# EAGLE design 64NIC+v1.3 (EAGLE 5.11)
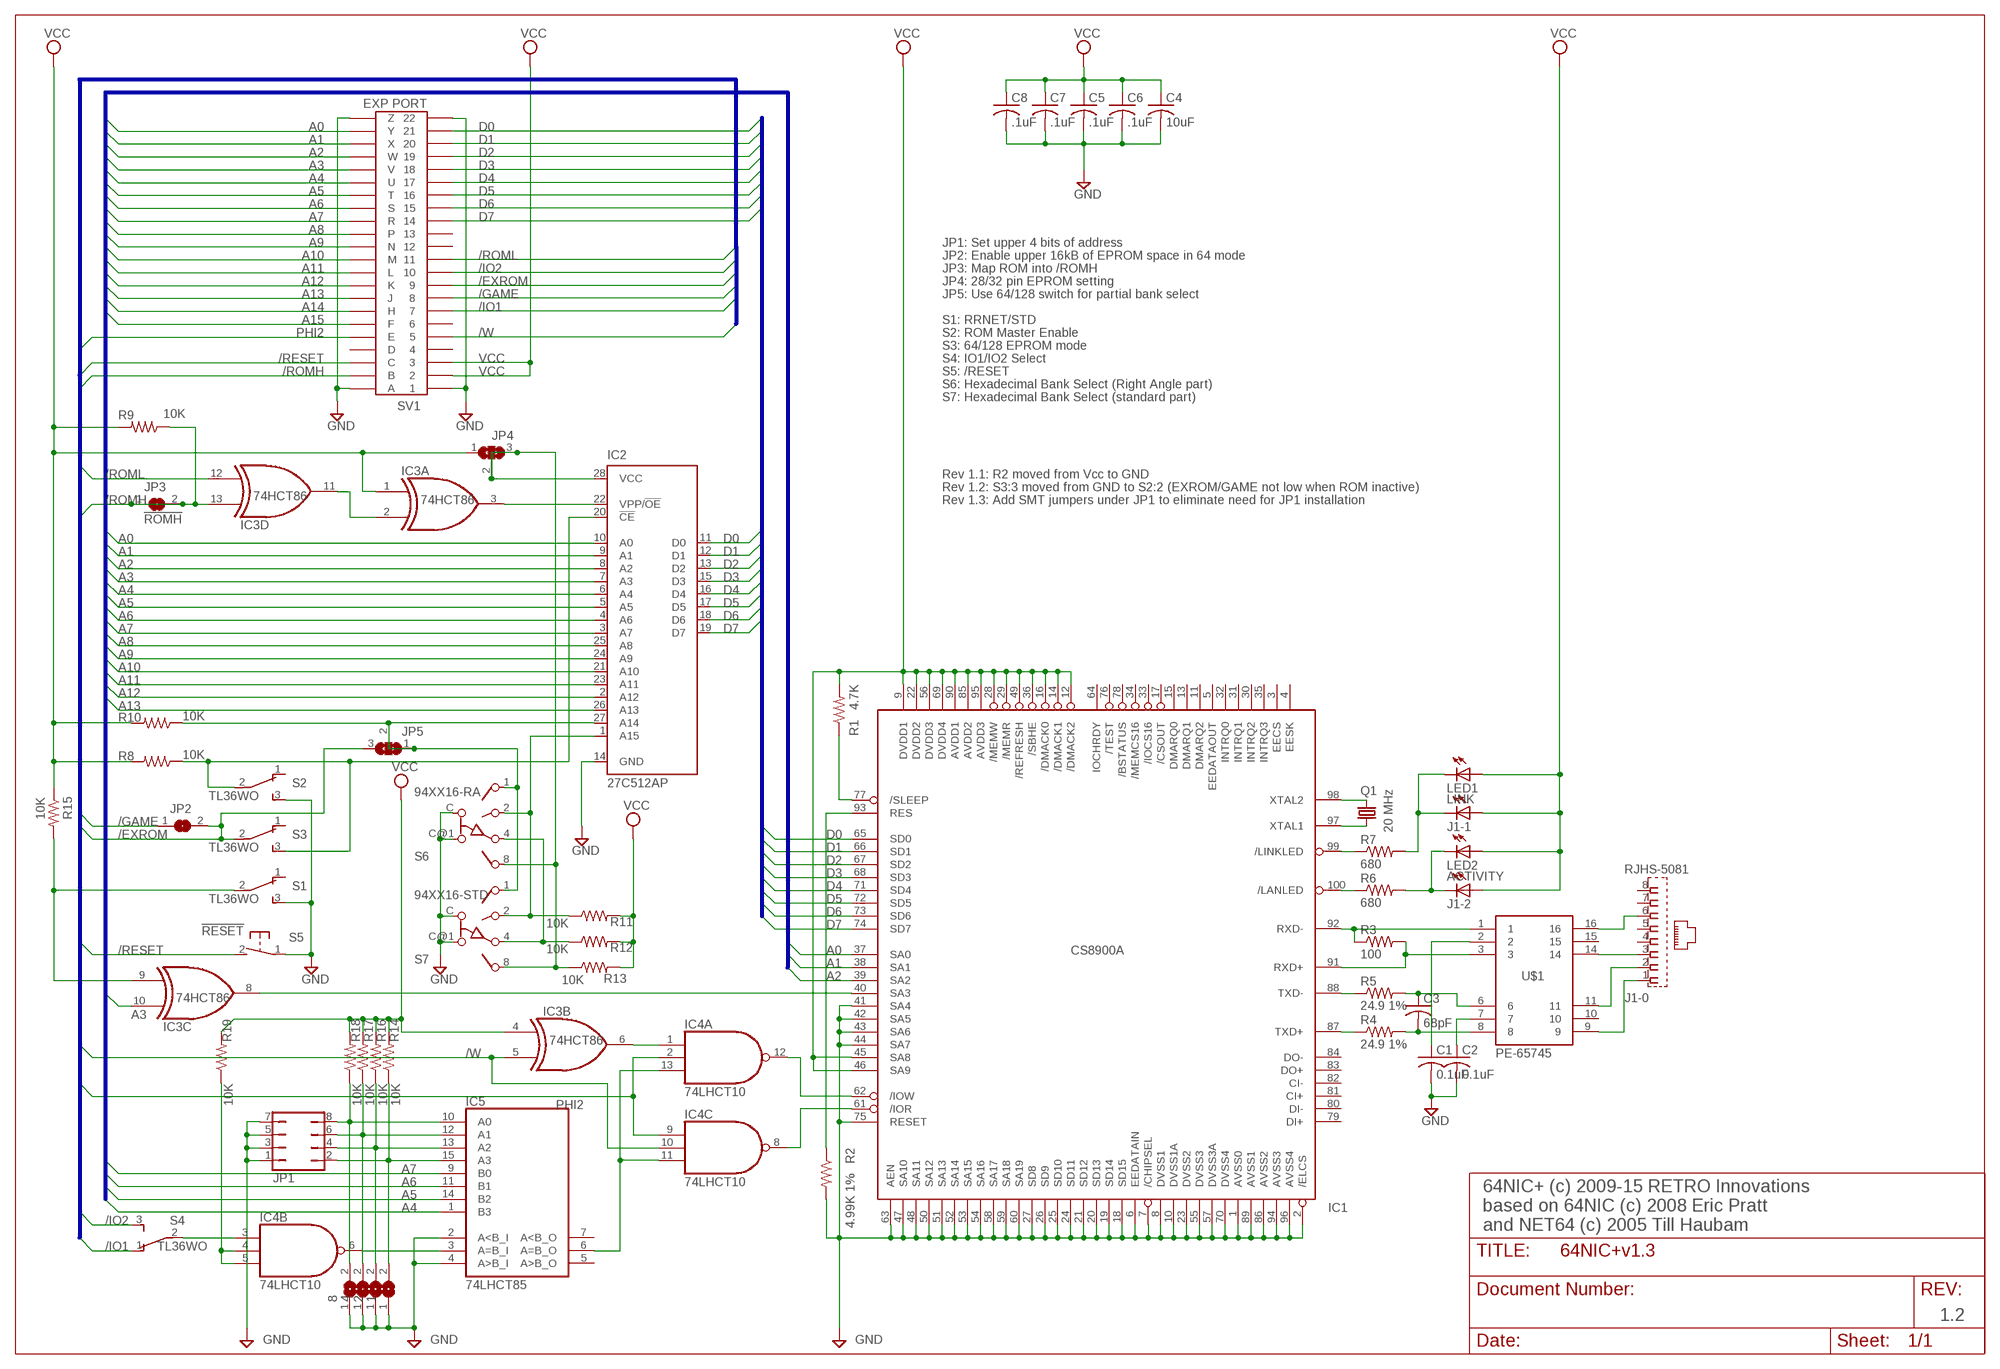
[diagram p0: schematic, sheet 1]

## Parts
1  SJ  [SJ]
2  SJ  [SJ]
4  SJ  [SJ]
8  SJ  [SJ]
C1  0.1uF  C-USC0805  [C0805]
C2  0.1uF  C-USC0805  [C0805]
C3  68pF  C-USC0805  [C0805]
C4  10uF  C-USC0805  [C0805]
C5  .1uF  C-USC0805  [C0805]
C6  .1uF  C-USC0805  [C0805]
C7  .1uF  C-USC0805  [C0805]
C8  .1uF  C-USC0805  [C0805]
IC1  CS8900A  [TQFP100]
IC2  27C512AP  [DIL28-6]
IC3  74HCT86  74S86D  [SO14]
IC4  74LHCT10  74LS10D  [SO14]
IC5  74LHCT85  74LS85D  [SO16]
J1  RJHS-5081  [RJHS-508]
JP1  JP4Q  [JP4Q]
JP2  SJ  [SJ]
JP3  !ROMH  SJ  [SJ]
JP4  SJ2W  [SJ_2]
JP5  SJ2W  [SJ_2]
LED1  LINK  LED3MM  [LED3MM]
LED2  ACTIVITY  LED3MM  [LED3MM]
Q1  20 MHz  CRYSTALHC49S  [HC49/S]
R1  4.7K  R-US_R0805  [R0805]
R2  4.99K 1%  R-US_R0805  [R0805]
R3  100  R-US_R0805  [R0805]
R4  24.9 1%  R-US_R0805  [R0805]
R5  24.9 1%  R-US_R0805  [R0805]
R6  680  R-US_R0805  [R0805]
R7  680  R-US_R0805  [R0805]
R8  10K  R-US_R0805  [R0805]
R9  10K  R-US_R0805  [R0805]
R10  10K  R-US_R0805  [R0805]
R11  10K  R-US_R0805  [R0805]
R12  10K  R-US_R0805  [R0805]
R13  10K  R-US_R0805  [R0805]
R14  10K  R-US_R0805  [R0805]
R15  10K  R-US_R0805  [R0805]
R16  10K  R-US_R0805  [R0805]
R17  10K  R-US_R0805  [R0805]
R18  10K  R-US_R0805  [R0805]
R19  10K  R-US_R0805  [R0805]
S1  TL36WO  [TL3XWO]
S2  TL36WO  [TL3XWO]
S3  TL36WO  [TL3XWO]
S4  TL36WO  [TL3XWO]
S5  !RESET  31-XX  [B3F-31XX]
S6  94XX16-RA  [HEX_SW_RA]
S7  94XX16-STD  [HEX-SW]
SV1  EXP PORT  44PINEDGE  [44PINEDGE]
U$1  PE-65745  [SMT4]

## Nets
/EXROM: JP2.2 JP5.3 S3.2(P) SV1.9
/GAME: JP2.1 SV1.8
/IO1: S4.1(O) SV1.7
/IO2: S4.3(S) SV1.10
/RESET: S5.2(S) SV1.C
/ROMH: IC3.13(D:I1) JP3.1 JP3.2 R9.1 SV1.B
/ROML: IC3.12(D:I0) SV1.11
/W: IC3.5(B:I1) IC4.10(C:I1) SV1.5
A0: IC1.37(SA0) IC2.10(A0) SV1.Y
A1: IC1.38(SA1) IC2.9(A1) SV1.X
A2: IC1.39(SA2) IC2.8(A2) SV1.W
A3: IC2.7(A3) IC3.10(C:I1) SV1.V
A4: IC2.6(A4) IC5.1(B3) SV1.U
A5: IC2.5(A5) IC5.14(B2) SV1.T
A6: IC2.4(A6) IC5.11(B1) SV1.S
A7: IC2.3(A7) IC5.9(B0) SV1.R
A8: IC2.25(A8) SV1.P
A9: IC2.24(A9) SV1.N
A10: IC2.21(A10) SV1.M
A11: IC2.23(A11) SV1.L
A12: IC2.2(A12) SV1.K
A13: IC2.26(A13) SV1.J
A14: SV1.H
A15: SV1.F
D0: IC1.65(SD0) IC2.11(D0) SV1.21
D1: IC1.66(SD1) IC2.12(D1) SV1.20
D2: IC1.67(SD2) IC2.13(D2) SV1.19
D3: IC1.68(SD3) IC2.15(D3) SV1.18
D4: IC1.71(SD4) IC2.16(D4) SV1.17
D5: IC1.72(SD5) IC2.17(D5) SV1.16
D6: IC1.73(SD6) IC2.18(D6) SV1.15
D7: IC1.74(SD7) IC2.19(D7) SV1.14
GND: 1.1 2.1 4.1 8.1 C1.2 C2.2 C4.2 C5.2 C6.2 C7.2 C8.2 IC1.1(AVSS0) IC1.2(/ELCS) IC1.6(EEDATAIN) IC1.7(/CHIPSEL) IC1.8(DVSS1) IC1.10(DVSS1A) IC1.18(SD15) IC1.19(SD14) IC1.20(SD13) IC1.21(SD12) IC1.23(DVSS2) IC1.24(SD11) IC1.25(SD10) IC1.26(SD9) IC1.27(SD8) IC1.41(SA4) IC1.42(SA5) IC1.43(SA6) IC1.44(SA7) IC1.47(SA10) IC1.48(SA11) IC1.50(SA12) IC1.51(SA13) IC1.52(SA14) IC1.53(SA15) IC1.54(SA16) IC1.55(DVSS3) IC1.57(DVSS3A) IC1.58(SA17) IC1.59(SA18) IC1.60(SA19) IC1.63(AEN) IC1.70(DVSS4) IC1.75(RESET) IC1.86(AVSS2) IC1.89(AVSS1) IC1.94(AVSS3) IC1.96(AVSS4) IC2.14(GND) IC5.2(A<B_I) IC5.4(A>B_I) JP1.1 JP1.3 JP1.5 JP1.7 R2.2 S1.3(S) S2.3(S) S5.1(P) S6.C S6.C@1(C) S7.C S7.C@1(C) SV1.1 SV1.22 SV1.A SV1.Z
N$1: IC1.40(SA3) IC3.8(C:O)
N$2: IC1.98(XTAL2) Q1.2
N$3: IC1.97(XTAL1) Q1.1
N$4: IC2.22(VPP/!OE) IC3.3(A:O)
N$5: IC3.2(A:I1) IC3.11(D:O)
N$6: IC1.93(RES) R2.1
N$7: IC1.77(/SLEEP) R1.1
N$8: IC1.62(/IOW) IC4.12(A:O)
N$9: IC1.61(/IOR) IC4.8(C:O)
N$10: IC4.11(C:I2) IC4.13(A:I2) IC5.6(A=B_O)
N$12: IC4.3(B:I0) S4.2(P)
N$14: IC4.6(B:O) IC5.3(A=B_I)
N$15: IC3.6(B:O) IC4.1(A:I0)
N$17: IC4.4(B:I1) IC4.5(B:I2) R19.1
N$19: 8.2 IC5.10(A0) JP1.8 R18.1
N$22: 4.2 IC5.12(A1) JP1.6 R17.1
N$23: IC1.92(RXD-) R3.1 U$1.1
N$24: IC1.91(RXD+) R3.2 U$1.3
N$25: IC1.88(TXD-) R5.1
N$26: IC1.87(TXD+) R4.1
N$27: C3.1 R5.2 U$1.6
N$28: C3.2 R4.2 U$1.8
N$29: J1.6 U$1.16
N$30: J1.3 U$1.14
N$31: J1.2 U$1.11
N$32: J1.1 U$1.9
N$33: IC1.99(/LINKLED) R7.1
N$34: IC1.100(/LANLED) R6.1
N$35: J1.9(-1:C) LED1.K(C) R7.2
N$36: J1.11(-2:C) LED2.K(C) R6.2
N$37: C2.1 U$1.7
N$38: C1.1 U$1.2
N$39: 2.2 IC5.13(A2) JP1.4 R16.1
N$40: 1.2 IC5.15(A3) JP1.2 R14.1
N$43: IC2.20(!CE) R8.1 S2.2(P) S3.3(S)
N$48: IC3.9(C:I0) R15.2 S1.2(P)
PHI2: IC4.2(A:I1) IC4.9(C:I0) SV1.E
TA14: IC2.27(A14) JP5.1 JP5.2 R10.1 S6.1 S7.1
TA15: IC2.1(A15) R11.1 S6.2 S7.2
TA16: R12.1 S6.4 S7.4
TA17: IC2.28(VCC) JP4.2 JP4.3 R13.1 S6.8 S7.8
VCC: C4.1 C5.1 C6.1 C7.1 C8.1 IC1.9(DVDD1) IC1.12(/DMACK2) IC1.14(/DMACK1) IC1.16(/DMACK0) IC1.22(DVDD2) IC1.28(/MEMW) IC1.29(/MEMR) IC1.36(/SBHE) IC1.45(SA8) IC1.46(SA9) IC1.49(/REFRESH) IC1.56(DVDD3) IC1.69(DVDD4) IC1.85(AVDD2) IC1.90(AVDD1) IC1.95(AVDD3) IC3.1(A:I0) IC3.4(B:I0) J1.10(-1:A) J1.12(-2:A) JP4.1 LED1.A LED2.A R1.2 R8.2 R9.2 R10.2 R11.2 R12.2 R13.2 R14.2 R15.1 R16.2 R17.2 R18.2 R19.2 SV1.2 SV1.3
Unconnected: IC1.3(EECS) IC1.4(EESK) IC1.5(EEDATAOUT) IC1.11(DMARQ2) IC1.13(DMARQ1) IC1.15(DMARQ0) IC1.17(/CSOUT) IC1.30(INTRQ2) IC1.31(INTRQ1) IC1.32(INTRQ0) IC1.33(/IOCS16) IC1.34(/MEMCS16) IC1.35(INTRQ3) IC1.64(IOCHRDY) IC1.76(/TEST) IC1.78(/BSTATUS) IC1.79(DI+) IC1.80(DI-) IC1.81(CI+) IC1.82(CI-) IC1.83(DO+) IC1.84(DO-) IC5.5(A>B_O) IC5.7(A<B_O) J1.4 J1.5 J1.7 J1.8 S1.1(O) S2.1(O) S3.1(O) SV1.4 SV1.6 SV1.12 SV1.13 SV1.D U$1.10 U$1.15

## Buses
D[0..7]
A[0..15]
/R,/IO1,/GAME,/EXROM,/IO2,/ROML,/ROMH,/RESET,PHI2,/W

## Notes on the sheet
- JP1: Set upper 4 bits of address
- JP2: Enable upper 16kB of EPROM space in 64 mode
- JP3: Map ROM into /ROMH
- JP4: 28/32 pin EPROM setting
- JP5: Use 64/128 switch for partial bank select
- S1: RRNET/STD
- S2: ROM Master Enable
- S3: 64/128 EPROM mode
- S4: IO1/IO2 Select
- S5: /RESET
- S6: Hexadecimal Bank Select (Right Angle part)
- S7: Hexadecimal Bank Select (standard part)
- Rev 1.1: R2 moved from Vcc to GND
- Rev 1.2: S3:3 moved from GND to S2:2 (EXROM/GAME not low when ROM inactive)
- Rev 1.3: Add SMT jumpers under JP1 to eliminate need for JP1 installation
- 64NIC+ (c) 2009-15 RETRO Innovations
- based on 64NIC (c) 2008 Eric Pratt
- and NET64 (c) 2005 Till Haubam
- 1.2

## Power pins joined to a net without a drawn wire
GND: IC3.7(P:GND) IC4.7(P:GND) IC5.8(GND)
VCC: IC3.14(P:VCC) IC4.14(P:VCC) IC5.16(VCC)

## Library data of the parts
1 2 4 8 JP2 JP3 = jumper:SJ: SMD solder JUMPER
C1-C8 = rcl:C-US: CAPACITOR, American symbol
IC1 = cirrus-v1.0.2:CS8900A: Crystal LAN(TM) Ethernet Controller (Optimized for 8-bit mode applications)
IC2 = microchip:27*512A: CMOS EPROM 512 K (64 K x 8)
IC3 = 74xx-us:74*86: Quad 2-input EXCLUSIV-OR (XOR) gate
IC4 = 74xx-us:74*10: Triple 3-input NAND gate
IC5 = 74xx-us:74*85: 4-bit magnitude COMPARATOR
J1 = C64NIC:RJHS-508: MODULAR JACK 8 POS., RIGHT ANGLE, LOW PROFILE WITH LEDS
JP1 = jumper:JP4Q: JUMPER
JP4 JP5 = jumper:SJ2W: SMD solder JUMPER
LED1 LED2 = led:LED: LED OSRAM: - CHIPLED LG R971, LG N971, LY N971, LG Q971, LY Q971, LO R971, LY R971 LH N974, LH R974 LS Q976, LO Q976, LY Q976 LO Q996 - Hyper CHIPLED LW Q18S LB Q993, LB Q99A, LB R99A - SideLED LS A670, LO A670, LY A670, LG A670, LP A670 LB A673, LV A673, LT A673, LW A673 LH A674 LY A675 LS A676, LA A676, LO A676, LY A676, LW A676 LS A679, LY A679, LG A679 - Hyper Micro SIDELED® LS Y876, LA Y876, LO Y876, LY Y876 LT Y87S - SmartLED LW L88C, LW L88S LB L89C, LB L89S, LG L890 LS L89K, LO L89K, LY L89K LS L896, LA L896, LO L896, LY L896 - TOPLED LS T670, LO T670, LY T670, LG T670, LP T670 LSG T670, LSP T670, LSY T670, LOP T670, LYG T670 LG T671, LOG T671, LSG T671 LB T673, LV T673, LT T673, LW T673 LH T674 LS T676, LA T676, LO T676, LY T676, LB T676, LH T676, LSB T676, LW T676 LB T67C, LV T67C, LT T67C, LS T67K, LO T67K, LY T67K, LW E67C LS E67B, LA E67B, LO E67B, LY E67B, LB E67C, LV E67C, LT E67C LW T67C LS T679, LY T679, LG T679 LS T770, LO T770, LY T770, LG T770, LP T770 LB T773, LV T773, LT T773, LW T773 LH T774 LS E675, LA E675, LY E675, LS T675 LS T776, LA T776, LO T776, LY T776, LB T776 LHGB T686 LT T68C, LB T68C - Hyper Mini TOPLED® LB M676 - Mini TOPLED Santana® LG M470 LS M47K, LO M47K, LY M47K Source: http://www.osram.convergy.de LUXEON: - LUMILED® LXK2-PW12-R00, LXK2-PW12-S00, LXK2-PW14-U00, LXK2-PW14-V00 LXK2-PM12-R00, LXK2-PM12-S00, LXK2-PM14-U00 LXK2-PE12-Q00, LXK2-PE12-R00, LXK2-PE12-S00, LXK2-PE14-T00, LXK2-PE14-U00 LXK2-PB12-K00, LXK2-PB12-L00, LXK2-PB12-M00, LXK2-PB14-N00, LXK2-PB14-P00, LXK2-PB14-Q00 LXK2-PR12-L00, LXK2-PR12-M00, LXK2-PR14-Q00, LXK2-PR14-R00 LXK2-PD12-Q00, LXK2-PD12-R00, LXK2-PD12-S00 LXK2-PH12-R00, LXK2-PH12-S00 LXK2-PL12-P00, LXK2-PL12-Q00, LXK2-PL12-R00 Source: www.luxeon.com KINGBRIGHT: KA-3528ASYC Source: www.kingbright.com
Q1 = crystal:CRYSTAL: CRYSTAL
R1-R19 = resistor:R-US_: RESISTOR, American symbol
S1-S4 = switch:TL36WO: TINY SWITCH ON - ON Source: http://www2.produktinfo.conrad.com/datenblaetter/700000-724999/705152-da-01-de-Subminiaturschalter_TL_36WO.pdf
S5 = switch-omron:31-XX: OMRON SWITCH
S6 S7 = switch-grayhill:94XX16
SV1 = edge-100:44PINEDGE: 44 PIN EDGE CONNECTOR FOR PCB
U$1 = C64NIC:PE-65745: 10Base-T Isolation Transformer - Rx ratio = 1:1; Tx ratio = 1:1.414

## Board
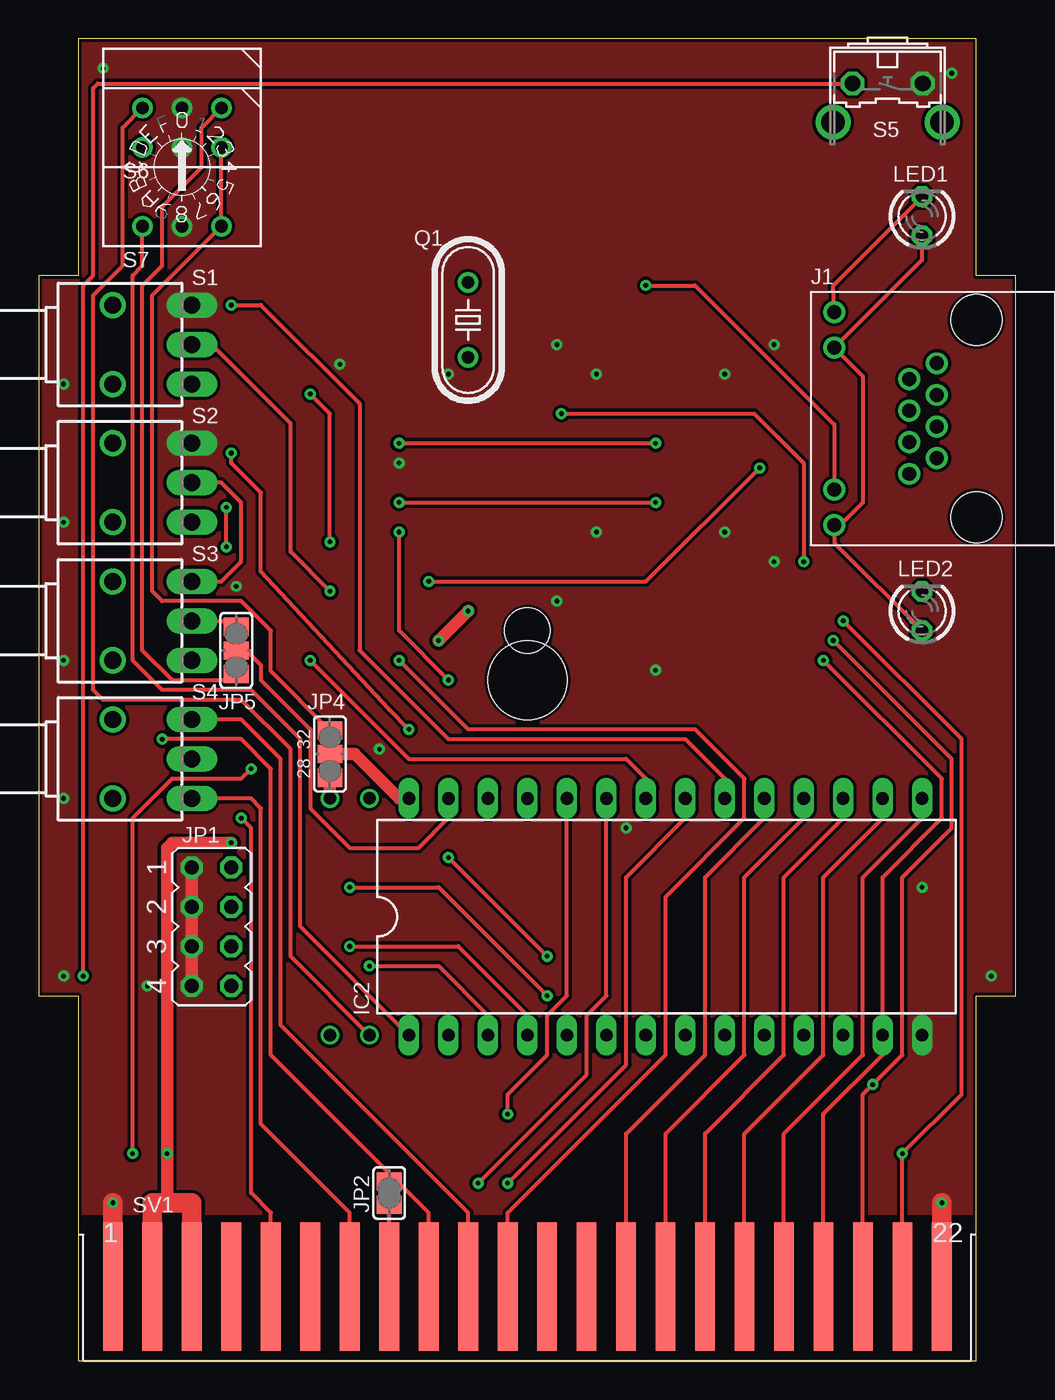
[diagram p1: board, top side]
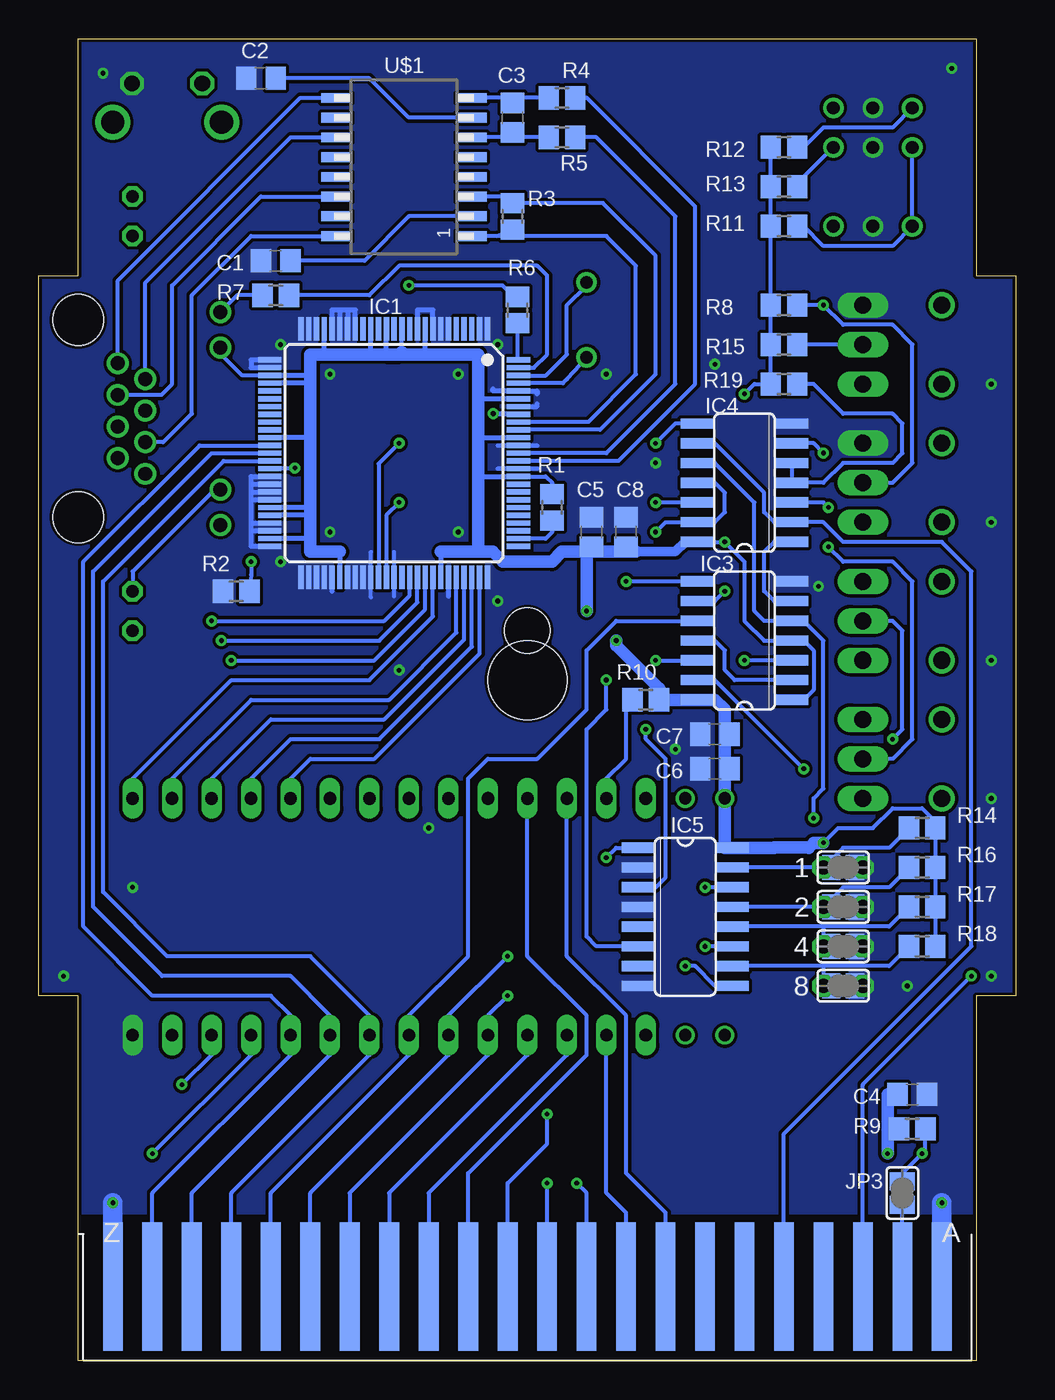
[diagram p2: board, bottom side, seen from below]

Size 62.86 x 85.08 mm. Coordinates in mm from the lower left corner, seen from the top.
Outline: 2.54,0 60.32,0 60.32,23.49 62.86,23.49 62.86,69.85 60.32,69.85 60.32,85.08 2.54,85.08 2.54,69.85 0,69.85 0,23.49 2.54,23.49 2.54,0
Copper layers (1*16): Top 0.035mm / dielectric 1.5mm / Bottom 0.035mm
Design rules "default *": minimum track width 8mil, minimum drill 8mil, track to track 8mil, track to pad 8mil, pad to pad 8mil, via to via 8mil, smd to smd 8mil, copper to edge 8mil, drill to drill 8mil, minimum pad ring 10mil, minimum via ring 8mil, stop-mask expansion 4mil, vias tented up to drill 0mil, thermal gap 10mil
Holes 5.08 mm at 31.43,43.81
Holes 2.92 mm at 31.43,46.98
bRestrict: area 10.8,30.8 to 11.1,32.7; area 10.8,28.3 to 11.1,30.2; area 10.8,25.7 to 11.1,27.6; area 10.8,23.2 to 11.1,25.1

### Footprints (pad centres in the part's own frame; a part is rotated, then mirrored left to right if it is on the bottom)
SJ = smd 1.168 x 1.6: 1 -0.762,0; 2 0.762,0
C0805 = smd 1.3 x 1.5: 1 -0.95,0; 2 0.95,0
TQFP100 = smd 1.5 x 0.34: 1 -8,6; 2 -8,5.5; 3 -8,5; 4 -8,4.5; 5 -8,4; 6 -8,3.5; 7 -8,3; 8 -8,2.5; 9 -8,2; 10 -8,1.5; 11 -8,1; 12 -8,0.5; 13 -8,0; 14 -8,-0.5; 15 -8,-1; 16 -8,-1.5; 17 -8,-2; 18 -8,-2.5; 19 -8,-3; 20 -8,-3.5; 21 -8,-4; 22 -8,-4.5; 23 -8,-5; 24 -8,-5.5; 25 -8,-6; 51 8,-6; 52 8,-5.5; 53 8,-5; 54 8,-4.5; 55 8,-4; 56 8,-3.5; 57 8,-3; 58 8,-2.5; 59 8,-2; 60 8,-1.5; 61 8,-1; 62 8,-0.5; 63 8,0; 64 8,0.5; 65 8,1; 66 8,1.5; 67 8,2; 68 8,2.5; 69 8,3; 70 8,3.5; 71 8,4; 72 8,4.5; 73 8,5; 74 8,5.5; 75 8,6 | smd 0.34 x 1.5: 26 -6,-8; 27 -5.5,-8; 28 -5,-8; 29 -4.5,-8; 30 -4,-8; 31 -3.5,-8; 32 -3,-8; 33 -2.5,-8; 34 -2,-8; 35 -1.5,-8; 36 -1,-8; 37 -0.5,-8; 38 0,-8; 39 0.5,-8; 40 1,-8; 41 1.5,-8; 42 2,-8; 43 2.5,-8; 44 3,-8; 45 3.5,-8; 46 4,-8; 47 4.5,-8; 48 5,-8; 49 5.5,-8; 50 6,-8; 76 6,8; 77 5.5,8; 78 5,8; 79 4.5,8; 80 4,8; 81 3.5,8; 82 3,8; 83 2.5,8; 84 2,8; 85 1.5,8; 86 1,8; 87 0.5,8; 88 0,8; 89 -0.5,8; 90 -1,8; 91 -1.5,8; 92 -2,8; 93 -2.5,8; 94 -3,8; 95 -3.5,8; 96 -4,8; 97 -4.5,8; 98 -5,8; 99 -5.5,8; 100 -6,8
DIL28-6 = drill 0.813 long: 1 -16.51,-7.62; 2 -13.97,-7.62; 3 -11.43,-7.62; 4 -8.89,-7.62; 5 -6.35,-7.62; 6 -3.81,-7.62; 7 -1.27,-7.62; 8 1.27,-7.62; 9 3.81,-7.62; 10 6.35,-7.62; 11 8.89,-7.62; 12 11.43,-7.62; 13 13.97,-7.62; 14 16.51,-7.62; 15 16.51,7.62; 16 13.97,7.62; 17 11.43,7.62; 18 8.89,7.62; 19 6.35,7.62; 20 3.81,7.62; 21 1.27,7.62; 22 -1.27,7.62; 23 -3.81,7.62; 24 -6.35,7.62; 25 -8.89,7.62; 26 -11.43,7.62; 27 -13.97,7.62; 28 -16.51,7.62
SO14 = smd 0.66 x 2.032: 1 -3.81,-3.073; 2 -2.54,-3.073; 3 -1.27,-3.073; 4 0,-3.073; 5 1.27,-3.073; 6 2.54,-3.073; 7 3.81,-3.073; 8 3.81,3.073; 9 2.54,3.073; 10 1.27,3.073; 11 0,3.073; 12 -1.27,3.073; 13 -2.54,3.073; 14 -3.81,3.073
SO16 = smd 0.66 x 2.032: 1 -4.445,-3.073; 2 -3.175,-3.073; 3 -1.905,-3.073; 4 -0.635,-3.073; 5 0.635,-3.073; 6 1.905,-3.073; 7 3.175,-3.073; 8 4.445,-3.073; 9 4.445,3.073; 10 3.175,3.073; 11 1.905,3.073; 12 0.635,3.073; 13 -0.635,3.073; 14 -1.905,3.073; 15 -3.175,3.073; 16 -4.445,3.073
RJHS-508 = drill 0.9 round: 1 3.556,-1.27; 2 2.54,0.508; 3 1.524,-1.27; 4 0.508,0.508; 5 -0.508,-1.27; 6 -1.524,0.508; 7 -2.54,-1.27; 8 -3.556,0.508; 9 6.858,5.334; 10 4.572,5.334; 11 -4.572,5.334; 12 -6.858,5.334 | hole 3.264: -6.35,-3.81; 6.35,-3.81
JP4Q = drill 0.914 octagon: 1 -3.81,-1.27; 2 -3.81,1.27; 3 -1.27,-1.27; 4 -1.27,1.27; 5 1.27,-1.27; 6 1.27,1.27; 7 3.81,-1.27; 8 3.81,1.27
SJ_2 = smd 1.168 x 1.6: 1 -1.524,0; 2 0,0; 3 1.524,0
LED3MM = drill 0.813 octagon: A -1.27,0; K 1.27,0
HC49/S = drill 0.813 round: 1 -2.413,0; 2 2.413,0
R0805 = smd 1.3 x 1.5: 1 -0.85,0; 2 0.85,0
TL3XWO = drill 1.1 pad 1.422 long: 1 -2.54,-5.08; 2 0,-5.08; 3 2.54,-5.08 | drill 1.1 pad 1.676 round: M1 -2.54,0; M2 2.54,0
B3F-31XX = drill 1.016 octagon: 1 -2.261,-1.245; 2 2.261,-1.245 | drill 1.499 pad 2.159 round: 3 -3.505,1.245; 4 3.505,1.245
HEX_SW_RA = drill 0.813 round: 1 -2.54,1.27; 2 2.54,3.81; 4 2.54,1.27; 8 -2.54,3.81; C 0,3.81; C@1 0,1.27
HEX-SW = drill 0.813 round: 1 -2.54,-3.81; 2 2.54,3.81; 4 2.54,-3.81; 8 -2.54,3.81; C 0,3.81; C@1 0,-3.81
44PINEDGE = smd 1.27 x 8.255: 1 -24.765,-0.305; 2 -22.225,-0.305; 3 -19.685,-0.305; 4 -17.145,-0.305; 5 -14.605,-0.305; 6 -12.065,-0.305; 7 -9.525,-0.305; 8 -6.985,-0.305; 9 -4.445,-0.305; 10 -1.905,-0.305; 11 0.635,-0.305; 12 3.175,-0.305; 13 5.715,-0.305; 14 8.255,-0.305; 15 10.795,-0.305; 16 13.335,-0.305; 17 15.875,-0.305; 18 18.415,-0.305; 19 20.955,-0.305; 20 23.495,-0.305; 21 26.035,-0.305; 22 28.575,-0.305 | smd 1.27 x 8.255 bottom: A -24.765,-0.305; B -22.225,-0.305; C -19.685,-0.305; D -17.145,-0.305; E -14.605,-0.305; F -12.065,-0.305; H -9.525,-0.305; J -6.985,-0.305; K -4.445,-0.305; L -1.905,-0.305; M 0.635,-0.305; N 3.175,-0.305; P 5.715,-0.305; R 8.255,-0.305; S 10.795,-0.305; T 13.335,-0.305; U 15.875,-0.305; V 18.415,-0.305; W 20.955,-0.305; X 23.495,-0.305; Y 26.035,-0.305; Z 28.575,-0.305
SMT4 = smd 0.635 x 1.905: 1 -4.445,-4.362; 2 -3.175,-4.362; 3 -1.905,-4.362; 4 -0.635,-4.362; 5 0.635,-4.362; 6 1.905,-4.362; 7 3.175,-4.362; 8 4.445,-4.362; 9 4.445,4.362; 10 3.175,4.362; 11 1.905,4.362; 12 0.635,4.362; 13 -0.635,4.362; 14 -1.905,4.362; 15 -3.175,4.362; 16 -4.445,4.362

### Placement (x,y rotation side)
1  11.11,31.75 180 bottom
2  11.11,29.2 180 bottom
4  11.11,26.66 180 bottom
8  11.11,24.12 180 bottom
C1  47.62,70.8 180 bottom
C2  48.58,82.55 180 bottom
C3  32.39,80.01 90 bottom
C4  6.67,17.14 0 bottom
C5  27.3,53.34 90 bottom
C6  19.37,38.09 180 bottom
C7  19.37,40.32 180 bottom
C8  25.08,53.34 90 bottom
IC1  40,58.41 270 bottom
IC2  40.32,28.57 0 top
IC3  17.46,46.35 90 bottom
IC4  17.46,56.51 90 bottom
IC5  21.27,28.57 270 bottom
J1  56.52,60.64 90 top
JP1  11.11,27.93 270 top
JP2  22.54,10.79 90 top
JP3  7.3,10.79 90 bottom
JP4  18.73,39.05 90 top
JP5  12.7,45.71 90 top
LED1  56.83,73.66 90 top
LED2  56.83,48.26 90 top
Q1  27.62,66.99 90 top
R1  29.84,54.92 90 bottom
R2  50.17,49.52 180 bottom
R3  32.39,73.66 90 bottom
R4  29.21,81.28 180 bottom
R5  29.21,78.74 180 bottom
R6  32.07,67.62 90 bottom
R7  47.62,68.58 180 bottom
R8  14.92,67.94 180 bottom
R9  6.67,14.92 180 bottom
R10  23.81,42.54 0 bottom
R11  14.92,73.02 180 bottom
R12  14.92,78.1 180 bottom
R13  14.92,75.56 180 bottom
R14  6.03,34.29 0 bottom
R15  14.92,65.4 0 bottom
R16  6.03,31.75 0 bottom
R17  6.03,29.2 0 bottom
R18  6.03,26.66 0 bottom
R19  14.92,62.86 180 bottom
S1  4.76,65.4 90 top
S2  4.76,56.51 90 top
S3  4.76,47.62 90 top
S4  4.76,38.73 90 top
S5  54.61,80.96 180 top
S6  9.21,81.91 180 top
S7  9.21,76.83 180 top
SV1  29.53,5.08 0 top
U$1  39.37,76.83 90 bottom

### Tracks (layer width: path | path; a pad name or v marks a point on that pad's centre or on a via)
/EXROM  (via drill 0.3)
  Top 0.254: 22.23,12.38 25.08,9.52 SV1.9 | 22.23,12.38 14.92,19.68 14.92,38.09 13.02,40 v7.94,40 | JP2.2 22.54,12.06 22.23,12.38 | JP5.3 12.95,47.62 S3.2
  Bottom 0.254: v7.94,40 7.3,40.63 7.3,46.98 7.94,47.62 S3.2
/GAME
  Top 0.254: SV1.8 JP2.1
/IO1
  Top 0.254: SV1.7 20,9.52 14.29,15.23 14.29,35.55 13.65,36.19 S4.1
/IO2
  Top 0.254: SV1.10 27.62,9.52 15.56,21.59 15.56,38.73 13.02,41.27 S4.3
/RESET  (via drill 0.3)
  Top 0.254: v2.86,24.76 2.86,69.21 3.49,69.85 3.49,81.91 3.78,82.2 S5.2
  Bottom 0.254: SV1.C 9.84,17.78 v2.86,24.76
/ROMH  (via drill 0.3)
  Top 0.254: v13.65,38.09 13.02,37.46 8.57,37.46 6.03,34.92 v6.03,13.33
  Bottom 0.254: SV1.B JP3.1 JP3.2 7.3,12.06 v6.03,13.33 5.82,13.33 R9.1 | IC3.13 19.37,43.81 v13.65,38.09
/ROML  (via drill 0.3)
  Top 0.254: SV1.11 30.16,9.52 40.32,19.68 40.32,29.84 45.4,34.92 45.4,37.46 42.23,40.63 27.62,40.63 v23.18,45.08
  Bottom 0.254: v23.18,45.08 IC3.12
/W  (via drill 0.3)
  Top 0.254: SV1.5 14.92,9.52 13.65,10.79 13.65,34.29 v13.02,34.92
  Bottom 0.254: v13.02,34.92 13.02,36.19 12.38,36.83 12.38,46.35 13.65,47.62 IC3.5 16.19,47.62 16.83,48.26 16.83,55.24 19.37,57.78 IC4.10
A0
  Bottom 0.254: SV1.Y 55.56,10.79 46.67,19.68 IC2.10 46.67,22.22 47.94,23.49 55.56,23.49 60.01,27.93 60.01,51.43 52.52,58.91 IC1.37
A1
  Bottom 0.254: SV1.X 53.02,10.79 44.13,19.68 IC2.9 44.13,22.22 46.67,24.76 54.93,24.76 59.37,29.2 59.37,50.8 51.75,58.41 IC1.38
A2
  Bottom 0.254: SV1.W 50.48,10.79 41.59,19.68 IC2.8 41.59,22.22 45.4,26.03 54.61,26.03 58.74,30.16 58.74,50.16 50.98,57.91 IC1.39
A3
  Bottom 0.254: SV1.V 47.94,10.79 39.05,19.68 IC2.7 39.05,22.22 35.24,26.03 35.24,37.46 33.97,38.73 30.8,38.73 27.62,41.91 27.62,45.71 25.72,47.62 IC3.10
A4  (via drill 0.3)
  Top 0.254: v32.7,26.03 v26.35,32.38
  Bottom 0.254: SV1.U 45.4,10.79 36.51,19.68 IC2.6 36.51,22.22 v32.7,26.03 | v26.35,32.38 25.72,33.02 IC5.1
A5  (via drill 0.3)
  Top 0.254: v32.7,23.49 25.72,30.48 v20,30.48
  Bottom 0.254: SV1.T 42.86,10.79 33.97,19.68 IC2.5 33.97,22.22 v32.7,23.49 | IC5.14 v20,30.48
A6  (via drill 0.3)
  Top 0.254: IC2.4 31.43,22.22 26.99,26.66 v20,26.66
  Bottom 0.254: SV1.S 40.32,10.79 31.43,19.68 IC2.4 | IC5.11 v20,26.66
A7  (via drill 0.3)
  Top 0.254: IC2.3 28.89,22.22 25.72,25.39 v21.27,25.39
  Bottom 0.254: SV1.R 37.78,10.79 28.89,19.68 IC2.3 | v21.27,25.39 20.64,25.39 19.37,24.12 IC5.9
A8
  Bottom 0.254: IC2.25 31.43,26.03 27.62,22.22 27.62,19.68 35.24,12.06 SV1.P
A9  (via drill 0.3)
  Top 0.254: v30.16,15.87 30.16,17.14 32.7,19.68 32.7,22.22 33.97,23.49 IC2.24
  Bottom 0.254: SV1.N 32.7,11.43 30.16,13.96 v30.16,15.87
A10  (via drill 0.3)
  Top 0.254: v30.16,11.43 37.78,19.05 37.78,31.11 41.59,34.92 IC2.21
  Bottom 0.254: SV1.M v30.16,11.43
A11  (via drill 0.3)
  Top 0.254: v28.26,11.43 35.24,18.41 35.24,22.22 36.51,23.49 IC2.23
  Bottom 0.254: SV1.L 27.62,10.79 v28.26,11.43
A12
  Bottom 0.254: SV1.K 25.08,9.52 26.35,10.79 IC2.2
A13
  Bottom 0.254: IC2.26 28.89,26.03 25.08,22.22 25.08,12.06 22.54,9.52 SV1.J
D0  (via drill 0.3)
  Top 0.254: SV1.21 v55.56,13.33 59.37,17.14 59.37,40 v51.75,47.62
  Bottom 0.254: v55.56,13.33 49.21,19.68 IC2.11 | IC1.65 39,49.26 40.64,47.62 v51.75,47.62
D1  (via drill 0.3)
  Top 0.254: SV1.20 53.02,17.14 v53.66,17.78 55.56,19.68 55.56,31.11 58.74,34.29 58.74,38.73 v51.12,46.35
  Bottom 0.254: v53.66,17.78 51.75,19.68 IC2.12 | v51.12,46.35 40.96,46.35 38.5,48.8 IC1.66
D2  (via drill 0.3)
  Top 0.254: SV1.19 50.48,15.87 54.29,19.68 IC2.13 54.29,31.11 58.1,34.92 58.1,37.46 v50.48,45.08
  Bottom 0.254: v50.48,45.08 41.28,45.08 38,48.35 IC1.67
D3
  Top 0.254: SV1.18 47.94,14.6 53.02,19.68 53.02,31.11 56.83,34.92 IC2.15
  Bottom 0.254: IC2.15 56.83,37.46 50.48,43.81 41.59,43.81 37.5,47.9 IC1.68
D4
  Top 0.254: SV1.17 45.4,14.6 50.48,19.68 50.48,31.11 54.29,34.92 IC2.16
  Bottom 0.254: IC2.16 54.29,37.46 49.21,42.54 40.32,42.54 36,46.86 IC1.71
D5
  Top 0.254: SV1.16 42.86,14.6 47.94,19.68 47.94,31.11 51.75,34.92 IC2.17
  Bottom 0.254: IC2.17 51.75,37.46 47.94,41.27 40.64,41.27 35.5,46.41 IC1.72
D6
  Top 0.254: SV1.15 40.32,14.6 45.4,19.68 45.4,31.11 49.21,34.92 IC2.18
  Bottom 0.254: IC2.18 49.21,37.46 46.67,40 40.96,40 35,45.95 IC1.73
D7
  Top 0.254: SV1.14 37.78,14.6 42.86,19.68 42.86,31.11 46.67,34.92 IC2.19
  Bottom 0.254: IC2.19 46.67,37.46 45.4,38.73 41.28,38.73 34.5,45.5 IC1.74
GND  (via drill 0.3)
  Top 0.813: JP1.7 JP1.5 JP1.3 JP1.1
  Top 1.27: v4.76,10.15 SV1.A | v58.1,10.15 SV1.Z
  Bottom 0.254: 41.5,49.12 IC1.60 41.5,52.06 | 40,49.21 IC1.63 40,52.06 | 8.1 JP1.7 | JP1.5 4.1 | JP1.3 2.1
  Bottom 0.305: 30.8,58.91 IC1.89 33.34,58.91 | 33.34,57.41 IC1.86 30.8,57.41
  Bottom 0.33: 33.66,62.54 33.66,62.41 IC1.96 30.8,62.41 30.8,62.23 | IC1.94 30.8,61.41 30.8,61.59 | IC1.8 37.5,67.62 38.5,67.62 IC1.10 | IC1.55 44,49.52 | IC1.41 49.21,56.91 49.21,56.41 | 49.21,56.41 IC1.42 | 49.21,55.91 IC1.43 | 49.21,55.91 49.21,56.41 | 49.21,55.41 49.21,55.91 | 49.21,55.41 IC1.44 | 49.21,53.91 IC1.47 | 49.21,53.91 49.21,55.41 | 49.21,53.41 IC1.48 | 49.21,53.41 49.21,53.91 | IC1.50 49.21,52.41 49.21,53.41 | IC1.21 44,67.62 43.5,67.62 | 43.5,67.62 IC1.20 | 43,67.62 IC1.19 | 43,67.62 43.5,67.62 | IC1.18 42.5,67.62 43,67.62 | IC1.26 49.21,64.42 49.21,63.91 IC1.27 | IC1.70 36.5,49.21 36.51,49.21
  Bottom 1.27: 4.76,3.17 SV1.A v4.76,10.15 | SV1.Z v58.1,10.15
  other vias: 35.88,63.49 44.13,63.49 35.88,53.34 44.13,53.34 39.69,44.45 4.13,83.18 58.74,82.86 33.34,65.4 47.31,65.4 47.31,51.43 1.59,24.76 61.28,24.76 19.37,64.13 26.35,63.49 1.59,62.86 1.59,53.97 1.59,45.08 1.59,36.19 23.18,57.78 33.34,48.89 37.78,34.29 56.83,30.48 21.91,39.37 6.99,24.12 12.7,49.84
  pour Top (no thermals): 2.54,85.09 2.54,69.85 0,69.85 0,23.49 2.54,23.49 2.54,9.52 60.33,9.52 60.33,23.49 62.86,23.49 62.86,69.85 60.33,69.85 60.33,85.09
  pour Bottom (no thermals): 2.54,9.52 60.33,9.52 60.33,23.49 62.86,23.49 62.86,69.85 60.33,69.85 60.33,85.09 2.54,85.09 2.54,69.85 0,69.85 0,23.49 2.54,23.49
N$1  (via drill 0.3)
  Top 0.254: v46.39,57.46 39.05,50.16 v25.08,50.16
  Bottom 0.254: IC1.40 46.4,57.41 v46.39,57.46 | IC3.8 v25.08,50.16
N$2
  Bottom 0.254: IC1.98 30.24,63.41 28.89,64.77 28.89,67.94 27.62,69.21 Q1.2
N$3
  Bottom 0.254: IC1.97 29.16,62.91 28.89,63.18 Q1.1
N$4  (via drill 0.3)
  Top 0.254: IC2.22 39.05,37.46 37.78,38.73 23.81,38.73 v17.46,45.08
  Bottom 0.254: IC3.3 v17.46,45.08
N$5
  Bottom 0.254: IC3.11 19.37,46.35 18.73,45.71 18.73,44.45 18.1,43.81 IC3.2
N$6  (via drill 0.3)
  Top 0.254: v33.62,60.95 46.04,60.95 49.21,57.78 v49.21,51.43
  Bottom 0.254: 33.61,60.91 v33.62,60.95 | v49.21,51.43 49.21,50.58 R2.1
  Bottom 0.33: IC1.93 33.61,60.91
N$7
  Bottom 0.254: R1.1 29.84,53.34 30.27,52.91 IC1.77
N$8  (via drill 0.3)
  Top 0.254: v23.18,55.24 v39.69,55.24
  Bottom 0.254: IC1.62 40.5,54.42 v39.69,55.24 | IC4.12 v23.18,55.24
N$9  (via drill 0.3)
  Top 0.254: v23.18,59.05 v39.69,59.05
  Bottom 0.254: IC1.61 41,57.73 v39.69,59.05 | IC4.8 21.91,60.32 v23.18,59.05
N$10  (via drill 0.3)
  Top 0.254: v23.18,53.34 23.18,46.98 v26.35,43.81
  Bottom 0.254: IC4.11 19.37,56.51 18.73,55.88 18.73,54.6 19.37,53.97 IC4.13 22.54,53.97 v23.18,53.34 | v26.35,43.81 26.35,41.91 27.62,40.63 27.62,27.3 26.99,26.66 IC5.6
N$11
  Top 0.254: 22.54,10.15 22.54,11.43
N$12  (via drill 0.3)
  Top 0.254: v12.06,52.38 v12.06,54.92
  Bottom 0.254: IC4.3 12.38,55.24 v12.06,54.92 | v12.06,52.38 11.11,51.43 7.94,51.43 6.67,50.16 6.67,40 7.94,38.73 S4.2
N$13  (via drill 0.8)
  other vias: 18.73,20.95
N$14  (via drill 0.3)
  Top 0.254: v12.38,58.41 12.38,57.78 14.29,55.88 14.29,50.8 22.54,41.91 v23.81,40.63
  Bottom 0.254: IC4.6 13.02,59.05 v12.38,58.41 | v23.81,40.63 23.81,40 22.54,38.73 22.54,31.11 23.18,30.48 IC5.3
N$15
  Bottom 0.254: 13.65,52.7 IC4.1 15.56,52.7 16.19,52.06 16.19,49.52 15.56,48.89 IC3.6
N$16
  Bottom 0.102: 11.75,31.75 10.48,31.75
N$17
  Bottom 0.254: 14.29,62.86 R19.1 13.02,62.86 11.11,60.95 7.94,60.95 7.3,60.32 7.3,58.41 7.94,57.78 11.11,57.78 12.38,56.51 IC4.4 IC4.5
N$18
  Bottom 0.102: 11.75,29.2 10.48,29.2
N$19
  Bottom 0.254: 12.38,25.39 8.15,25.39 R18.1 | 12.38,25.39 IC5.10 | 12.38,25.39 JP1.8 8.2
N$20
  Bottom 0.102: 11.75,26.66 10.48,26.66
N$21
  Bottom 0.102: 11.75,24.12 10.48,24.12
N$22
  Bottom 0.254: 12.38,27.93 IC5.12 | 12.38,27.93 JP1.6 4.2 | 12.38,27.93 8.15,27.93 R17.1
N$23
  Bottom 0.254: 33.44,72.39 U$1.1 | 33.44,72.39 R3.1 | 33.44,72.39 26.35,72.39 24.45,70.48 24.45,63.49 27.53,60.41 IC1.92
N$24
  Bottom 0.254: U$1.3 32.49,74.93 R3.2 26.57,74.51 23.18,71.12 23.18,63.49 26.76,59.91 IC1.91
N$25
  Bottom 0.254: IC1.88 26.35,58.41 21.91,62.86 21.91,73.66 26.99,78.74 R5.1
N$26
  Bottom 0.254: IC1.87 25.58,57.91 20.64,62.86 20.64,74.29 27.62,81.28 R4.1
N$27
  Bottom 0.254: U$1.6 32.71,78.74 C3.1 32.07,78.74 R5.2
N$28
  Bottom 0.254: U$1.8 32.71,81.28 C3.2 32.07,81.28 R4.2
N$29
  Bottom 0.254: U$1.16 49.21,72.39 53.02,68.58 53.02,60.95 54.86,59.11 J1.6
N$30
  Bottom 0.254: U$1.14 48.58,74.93 54.29,69.21 54.29,62.86 54.99,62.16 J1.3
N$31
  Bottom 0.254: U$1.11 46.67,78.74 56.01,69.4 J1.2
N$32
  Bottom 0.254: U$1.9 46.04,81.28 57.78,69.53 J1.1
N$33
  Bottom 0.254: IC1.99 31.01,63.91 30.16,64.77 30.16,69.85 30.8,70.48 39.69,70.48 41.59,68.58 R7.1
N$34
  Bottom 0.254: R6.1 32.07,64.48 IC1.100
N$35
  Top 0.254: LED1.K 51.12,69.21 J1.9
  Bottom 0.254: R7.2 50.1,68.58 J1.9
N$36  (via drill 0.3)
  Top 0.254: v39.05,69.21 42.23,69.21 51.18,60.26 J1.11
  Bottom 0.254: R6.2 32.28,68.47 33.02,69.21 v39.05,69.21 | J1.11 51.56,56.07 56.83,50.8 LED2.K
N$37
  Bottom 0.254: U$1.7 39.05,80.01 41.59,82.55 C2.1
N$38
  Bottom 0.254: U$1.2 39.05,73.66 41.91,70.8 C1.1
N$39
  Bottom 0.254: JP1.4 IC5.13 | JP1.4 11.11,30.48 8.15,30.48 R16.1 | JP1.4 2.2
N$40
  Bottom 0.254: JP1.2 IC5.15 | JP1.2 11.11,33.02 8.15,33.02 R14.1 | JP1.2 1.2
N$43  (via drill 0.3)
  Top 0.254: IC2.20 44.13,37.46 41.59,40 26.35,40 20.64,45.71 20.64,61.59 14.29,67.94 v12.38,67.94 | S2.2 11.75,56.51 13.02,55.24 13.02,51.43 11.75,50.16 S3.3
  Bottom 0.254: S2.2 7.94,56.51 6.67,57.78 6.67,65.4 7.94,66.67 11.11,66.67 v12.38,67.94 R8.1 | R8.1 13.65,68.58 | 14.29,67.94 14.07,68.16 R8.1
N$45  (via drill 0.8)
  other vias: 21.27,36.19
N$48  (via drill 0.3)
  Top 0.254: S1.2 11.11,65.4 16.19,60.32 16.19,52.06 v18.73,49.52
  Bottom 0.254: IC3.9 19.37,48.89 v18.73,49.52 | S1.2 R15.2
PHI2
  Bottom 0.254: IC4.9 19.37,59.05 16.19,55.88 16.19,54.6 15.56,53.97 IC4.2 12.38,53.97 11.11,52.7 4.76,52.7 2.86,50.8 2.86,26.66 14.92,14.6 SV1.E
TA14
  Top 0.254: S7.1 10.48,79.37 10.48,76.83 7.94,74.29 7.94,70.48 6.67,69.21 6.67,45.71 8.57,43.81 12.95,43.81 JP5.1 JP5.2 13.34,45.71 14.29,44.76 14.29,43.81 17.46,40.63 17.46,35.55 20,33.02 24.45,33.02 26.35,34.92 IC2.27
  Bottom 0.254: IC2.27 26.35,37.46 25.08,38.73 25.08,41.91 24.77,42.22 R10.1
TA15
  Top 0.254: IC2.1 16.83,27.93 16.83,40 13.65,43.17 7.94,43.17 6.03,45.08 6.03,69.85 6.67,70.48 S7.2
  Bottom 0.254: S6.2 S7.2 7.94,71.75 12.38,71.75 13.65,73.02 R11.1
TA16  (via drill 0.8)
  Top 0.254: v21.27,20.95 16.19,26.03 16.19,39.37 13.02,42.54 4.13,42.54 3.49,43.17 3.49,68.58 5.4,70.48 5.4,79.37 S7.4
  Bottom 0.254: R12.1 13.65,78.1 12.38,79.37 7.94,79.37 S7.4
TA17
  Top 0.254: S6.8 S7.8 7.3,68.58 7.3,49.52 7.94,48.89 13.02,48.89 14.92,46.98 14.92,44.38 JP4.3 JP4.2
  Top 0.813: JP4.2 20.32,39.05 23.18,36.19 IC2.28
  Bottom 0.254: R13.1 14.07,75.78 S6.8
VCC  (via drill 0.3, 0.8)
  Top 0.254: LED1.A 56.83,70.86 J1.10 53.02,63.37 53.02,55.24 51.56,53.78 J1.12 51.18,52.64 LED2.A | v18.73,52.7 18.73,60.95 v17.46,62.23
  Top 0.813: v25.72,46.35 v27.62,48.26 | v12.38,33.33 8.57,33.33 8.25,33.02 v8.25,13.33 8.25,10.15 | v18.73,36.19 JP4.1
  Top 1.27: SV1.2 7.3,10.15 8.25,10.15 9.84,10.15 9.84,9.84 SV1.3
  Bottom 0.254: 45.4,64.77 45.4,64.13 | IC1.85 30.25,56.91 29.84,56.51 R1.2 | J1.10 51.18,64.83 49.77,63.41 IC1.28 | IC1.12 39.5,64.9 39.37,64.77 | IC4.14 v18.73,52.7 17.46,51.43 17.46,47.62 16.19,46.35 IC3.4 13.65,46.35 13.02,45.71 13.02,43.17 13.65,42.54 IC3.1 | R15.1 R8.2 | R19.2 R15.1 | v17.46,62.23 16.83,62.86 R19.2 | R15.1 R11.2 R13.2 R12.2 | R18.2 R17.2 R16.2 R14.2 5.18,34.7 6.03,35.55 7.94,35.55 9.21,34.29 11.43,34.29 v12.38,33.33 | R19.2 R15.1
  Bottom 0.33: 38,64.77 IC1.9 | 34.61,56.91 IC1.85 | 40.5,64.77 IC1.14 | 41.5,64.77 IC1.16 | 44.5,64.77 IC1.22 | 45.4,59.41 IC1.36 | 45.4,54.91 IC1.45 | 45.4,54.41 IC1.46 | 45.4,52.91 IC1.49 | 34.61,61.91 IC1.95 | 45.48,63.41 IC1.28 | 34.56,59.41 IC1.90 | IC1.29 45.46,62.91 45.4,62.86 | IC1.56 43.5,52.06 | IC1.69 37,51.89 36.83,52.06
  Bottom 0.356: 45.4,53.02 45.4,52.91 | 34.61,56.83 34.61,56.91 | 45.4,63.49 arc90 45.48,63.41 | 34.61,59.37 34.56,59.41
  Bottom 0.61: C8.1 24.45,52.06 21.91,52.06 21.27,52.7 IC4.14 | 27.3,52.06 27.3,52.07 C5.1 | IC3.14 20.64,42.54
  Bottom 0.813: 39.05,64.77 38,64.77 34.61,64.77 34.61,61.91 34.61,59.37 34.61,56.83 34.61,52.06 | 39.05,64.77 39.37,64.77 | 43.5,52.06 45.4,52.06 45.4,53.02 45.4,54.41 45.4,54.91 45.4,59.41 45.4,62.86 45.4,63.49 45.4,64.77 44.5,64.77 41.5,64.77 40.5,64.77 | 34.61,52.06 36.83,52.06 37,52.06 | 34.61,52.06 33.66,52.06 33.02,51.43 29.84,51.43 29.21,52.07 27.3,52.07 | 40.5,64.77 39.64,64.77 39.5,64.9 | 39.05,64.77 40.5,64.77 | v27.62,48.26 27.62,52.06 | 27.62,52.06 24.45,52.06 | 27.62,52.06 C5.1 | 18.73,37.46 v18.73,36.19 18.73,33.02 IC5.16 15.55,33.02 13.34,33.02 13.02,33.33 v12.38,33.33 | 18.73,37.46 18.73,38.09 C6.1 | 18.73,37.46 18.73,40.63 | 18.73,40.63 18.73,41.91 19.37,42.54 IC3.14 | v25.72,46.35 25.72,46.03 22.96,43.28 R10.2 20.64,42.54 | v8.25,13.33 8.25,14.6 | 8.25,14.6 8.25,17.14 C4.1 | R9.2 7.52,14.6 8.25,14.6 | C7.1 18.73,40.32 18.73,40.63

### Text on the board
tPlace: 32 | 28
tValues: 64NI + | (c) 2009-15 RETRO Innovations | based on 64NIC (c) 2008 Eric Pratt | and NET64 (c) 2005 Till Harbaum | STD | RR-NET | EPROM | 64 MODE | TOGGLE | ROTARY | SN# | IO2 | WARNING: Do not allow both sides of JP4 to be connected! | IO1 | $dx10 | $dx20 | $dx40 | $dx80 | !GAME
bValues: !ROMH
bDocu: /ROMH